# Altium schematic sheet retros.SchDoc: Retros
size A4; Organization: Badgerloop Electrical; Address1: 133 Engineering Research Building; Address2: 1500 Engineering Drive; Address3: Madison, Wi 53706; SheetNumber: 8
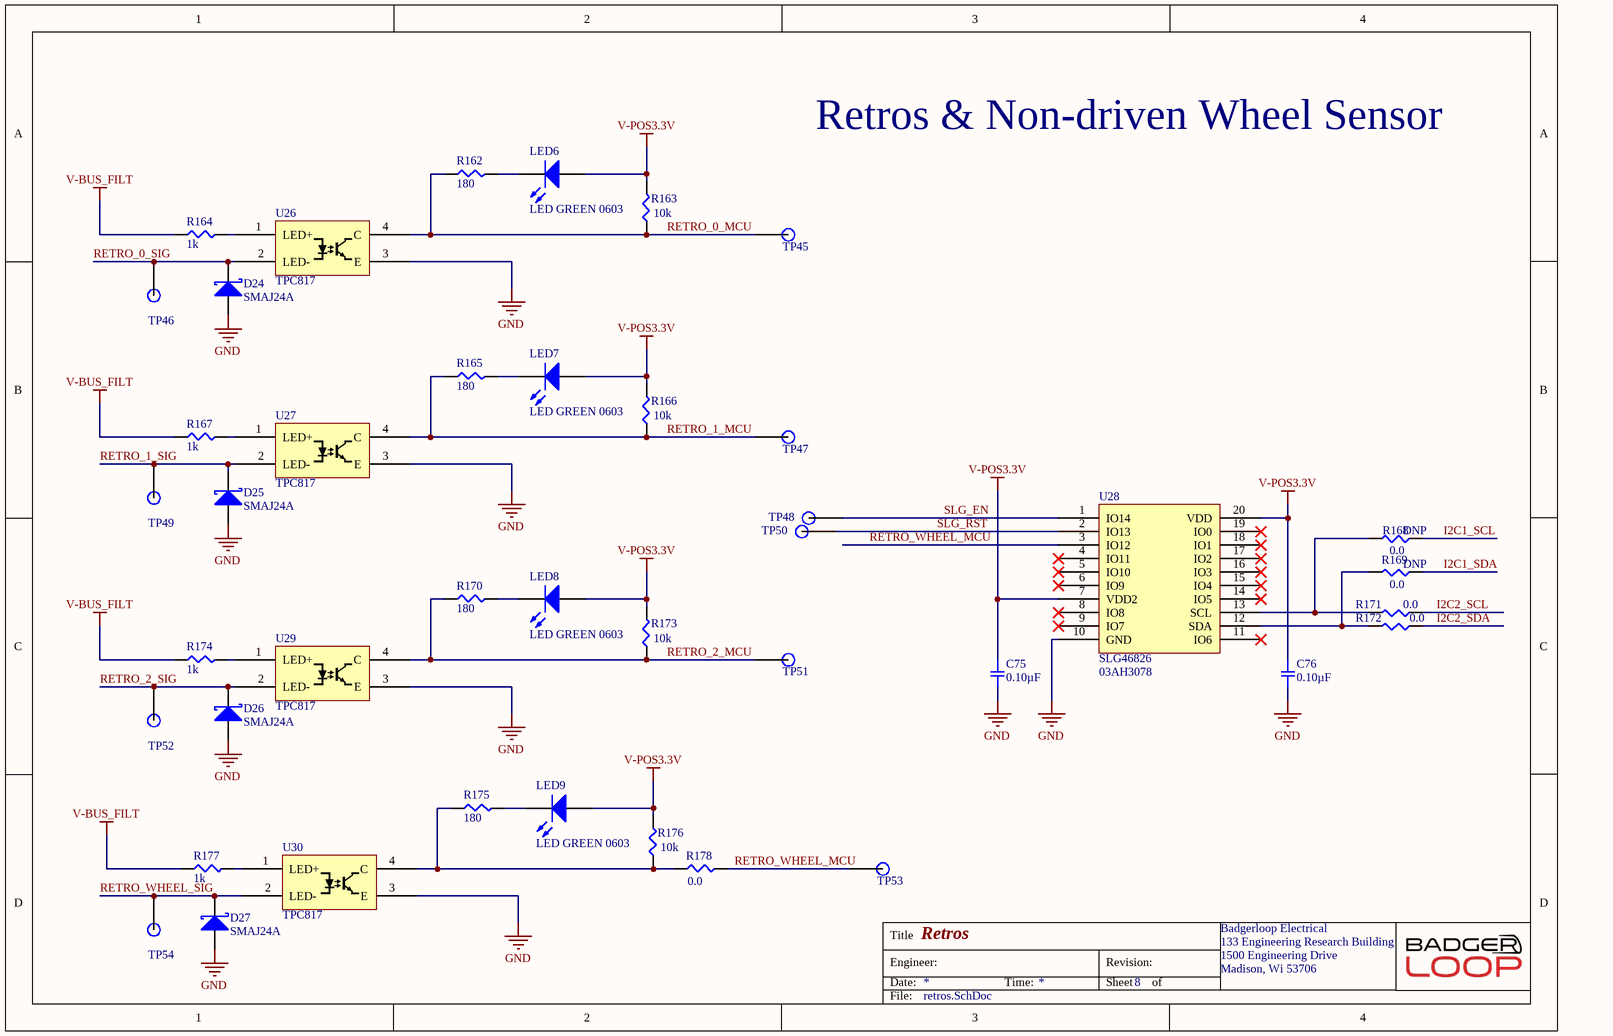
[diagram p0: retros.SchDoc]

## Parts
C75  0.10µF  [SMD-0805C]
C76  0.10µF  [SMD-0805C]
D24  SMAJ24A  [INDM5026X18N]
D25  SMAJ24A  [INDM5026X18N]
D26  SMAJ24A  [INDM5026X18N]
D27  SMAJ24A  [INDM5026X18N]
LED6  LED GREEN 0603  [LED 0603 GREEN]
LED7  LED GREEN 0603  [LED 0603 GREEN]
LED8  LED GREEN 0603  [LED 0603 GREEN]
LED9  LED GREEN 0603  [LED 0603 GREEN]
R162  180  [SMD-0805-RES]
R163  10k  [SMD-0805-RES]
R164  1k  [SMD-0805-RES]
R165  180  [SMD-0805-RES]
R166  10k  [SMD-0805-RES]
R167  1k  [SMD-0805-RES]
R168  0.0  [SMD-0805-RES]
R169  0.0  [SMD-0805-RES]
R170  180  [SMD-0805-RES]
R171  0.0  [SMD-0805-RES]
R172  0.0  [SMD-0805-RES]
R173  10k  [SMD-0805-RES]
R174  1k  [SMD-0805-RES]
R175  180  [SMD-0805-RES]
R176  10k  [SMD-0805-RES]
R177  1k  [SMD-0805-RES]
R178  0.0  [SMD-0805-RES]
TP45  TP  [Test Point]  (value not drawn)
TP46  TP  [Test Point]  (value not drawn)
TP47  TP  [Test Point]  (value not drawn)
TP48  TP  [Test Point]  (value not drawn)
TP49  TP  [Test Point]  (value not drawn)
TP50  TP  [Test Point]  (value not drawn)
TP51  TP  [Test Point]  (value not drawn)
TP52  TP  [Test Point]  (value not drawn)
TP53  TP  [Test Point]  (value not drawn)
TP54  TP  [Test Point]  (value not drawn)
U26  TPC817  [SOT200P1005X328-5N]
U27  TPC817  [SOT200P1005X328-5N]
U28  SLG46826  Supplier Part Number 1: 03AH3078  [SOP65P640X175-20N]
U29  TPC817  [SOT200P1005X328-5N]
U30  TPC817  [SOT200P1005X328-5N]

## Nets
GND: C75.2 C76.2 D24.2(K) D25.2(K) D26.2(K) D27.2(K) U26.3(E) U27.3(E) U28.10(GND) U29.3(E) U30.3(E)
V-BUS_FILT: R164.1 R167.1 R174.1 R177.1
V-POS3.3V: C75.1 C76.1 LED6.1(A) LED7.1(A) LED8.1(A) LED9.1(A) R163.2 R166.2 R173.2 R176.2 U28.7(VDD2) U28.20(VDD)
I2C1_SCL: R168.1
I2C1_SDA: R169.1
I2C2_SCL: R171.1
I2C2_SDA: R172.1
RETRO_0_MCU: R162.1 R163.1 TP45.1 U26.4(C)
RETRO_0_SIG: D24.1(A) TP46.1 U26.2(LED-)
RETRO_1_MCU: R165.1 R166.1 TP47.1 U27.4(C)
RETRO_1_SIG: D25.1(A) TP49.1 U27.2(LED-)
RETRO_2_MCU: R170.1 R173.1 TP51.1 U29.4(C)
RETRO_2_SIG: D26.1(A) TP52.1 U29.2(LED-)
RETRO_WHEEL_MCU: R178.2 TP53.1 U28.3(IO12)
RETRO_WHEEL_SIG: D27.1(A) TP54.1 U30.2(LED-)
SLG_EN: TP48.1 U28.1(IO14)
SLG_RST: TP50.1 U28.2(IO13)
NetLED6_2: LED6.2(K) R162.2
NetLED7_2: LED7.2(K) R165.2
NetLED8_2: LED8.2(K) R170.2
NetLED9_2: LED9.2(K) R175.2
NetR164_2: R164.2 U26.1(LED+)
NetR167_2: R167.2 U27.1(LED+)
NetR168_2: R168.2 R171.2 U28.13(SCL)
NetR169_2: R169.2 R172.2 U28.12(SDA)
NetR174_2: R174.2 U29.1(LED+)
NetR175_1: R175.1 R176.1 R178.1 U30.4(C)
NetR177_2: R177.2 U30.1(LED+)

Not connected (* = marked no-connect by the designer): U28 4(IO11)* 5(IO10)* 6(IO9)* 8(IO8)* 9(IO7)* 11(IO6)* 14(IO5)* 15(IO4)* 16(IO3)* 17(IO2)* 18(IO1)* 19(IO0)*

## Notes on the sheet
- Retros & Non-driven Wheel Sensor
- Title
- Engineer:
- Date:
- Time:
- Revision:
- Sheet
- of
- File:

## Library data of the parts
C75 C76 = GRM219R71E104KA01D: CAP CER 0.1UF 25V X7R 0805; Manufacturer: Murata Electronics North America; Factory Stock: 0; Unit Price (USD): 0.12; Minimum Quantity: 1; Tolerance: ±10%; Datasheets: http://www.murata.com/~/media/webrenewal/support/library/catalog/products/capacitor/mlcc/c02e.pdf; Image: //media.digikey.com/Renders/Murata%20Renders/0805%20(2012%20Metric)%20.85mm.jpg; Digi-Key Part Number: 490-12754-1-ND; Part Number: GRM219R71E104KA01D; Quantity Available: 8594; @ qty: 0; Packaging: Cut Tape (CT); Series: GRM; Part Status: Active; Value: 0.10µF; Voltage: 25V; Temperature Coefficient: X7R; Operating Temperature: -55°C ~ 125°C; Features: -; Ratings: -; Applications: General Purpose; Mounting Type: Surface Mount, MLCC; Package / Case: 0805 (2012 Metric); Size / Dimension: 0.079" L x 0.049" W (2.00mm x 1.25mm); Height - Seated (Max): -; Thickness (Max): 0.037" (0.95mm); Lead Spacing: -; Lead Style: -
D24-D27 = SMAJ24A: TVS DIODE 24V 38.9V DO214AC; Manufacturer: LittelFuse Inc; Digikey P/N: SMAJ24ALFCT-ND; Digikey Link: https://www.digikey.com/product-detail/en/littelfuse-inc/SMAJ24A/SMAJ24ALFCT-ND/762500; Manufacturer P/N: SMAJ24A
LED6-LED9 = LED GREEN 0603: Manufacturer: Lite-On Inc.; Manufacturer P/N: LTST-C190KGKT; Digikey P/N: 160-1435-1-ND; Package / Case: 0603; Color: GREEN
R162 R165 R170 R175 = ERJ-6ENF1800V: RES SMD 180 OHM 1% 1/8W 0805; Manufacturer: Panasonic Electronic Components; Factory Stock: 0; Unit Price (USD): 0.00729; @ qty: 1500; Minimum Quantity: 1; Power (Watts): 0.125W, 1/8W; Temperature Coefficient: ±100ppm/°C; Part Number: ERJ-6ENF1800V; Datasheets: http://industrial.panasonic.com/www-cgi/jvcr13pz.cgi?E+PZ+3+AOA0002+ERJ6ENF1800V+7+WW; Image: //media.digikey.com/Renders/Panasonic%20Renders/ERJ-0805%20Pkg.jpg; Digi-Key Part Number: P180CCT-ND; Quantity Available: 33231; Packaging: Cut Tape (CT); Series: ERJ; Part Status: Active; Value: 180; Tolerance: ±1%; Composition: Thick Film; Features: Automotive AEC-Q200; Operating Temperature: -55°C ~ 155°C; Package / Case: 0805 (2012 Metric); Supplier Device Package: 0805; Size / Dimension: 0.079" L x 0.049" W (2.00mm x 1.25mm); Height - Seated (Max): 0.028" (0.70mm); Number of Terminations: 2; Failure Rate: -
R163 R166 R173 R176 = ERJ-6GEYJ103V: RES SMD 10K OHM 5% 1/8W 0805; Manufacturer: Panasonic Electronic Components; Factory Stock: 0; Unit Price (USD): 0.00496; @ qty: 1500; Minimum Quantity: 1; Power (Watts): 0.125W, 1/8W; Temperature Coefficient: ±200ppm/°C; Part Number: ERJ-6GEYJ103V; Datasheets: http://industrial.panasonic.com/www-cgi/jvcr13pz.cgi?E+PZ+3+AOA0001+ERJ6GEYJ103V+7+WW; Image: //media.digikey.com/Renders/Panasonic%20Renders/ERJ-0805%20Pkg.jpg; Digi-Key Part Number: P10KACT-ND; Quantity Available: 2328224; Packaging: Cut Tape (CT); Series: ERJ; Part Status: Active; Value: 10k; Tolerance: ±5%; Composition: Thick Film; Features: Automotive AEC-Q200; Operating Temperature: -55°C ~ 155°C; Package / Case: 0805 (2012 Metric); Supplier Device Package: 0805; Size / Dimension: 0.079" L x 0.049" W (2.00mm x 1.25mm); Height - Seated (Max): 0.028" (0.70mm); Number of Terminations: 2; Failure Rate: -
R164 R167 R174 R177 = ERJ-6ENF1001V: RES SMD 1K OHM 1% 1/8W 0805; Manufacturer: Panasonic Electronic Components; Factory Stock: 0; Unit Price (USD): 0.00729; @ qty: 1500; Minimum Quantity: 1; Power (Watts): 0.125W, 1/8W; Temperature Coefficient: ±100ppm/°C; Part Number: ERJ-6ENF1001V; Datasheets: http://industrial.panasonic.com/www-cgi/jvcr13pz.cgi?E+PZ+3+AOA0002+ERJ6ENF1001V+7+WW; Image: //media.digikey.com/Renders/Panasonic%20Renders/ERJ-0805%20Pkg.jpg; Digi-Key Part Number: P1.00KCCT-ND; Quantity Available: 12895103; Packaging: Cut Tape (CT); Series: ERJ; Part Status: Active; Value: 1k; Tolerance: ±1%; Composition: Thick Film; Features: Automotive AEC-Q200; Operating Temperature: -55°C ~ 155°C; Package / Case: 0805 (2012 Metric); Supplier Device Package: 0805; Size / Dimension: 0.079" L x 0.049" W (2.00mm x 1.25mm); Height - Seated (Max): 0.028" (0.70mm); Number of Terminations: 2; Failure Rate: -
R168 R169 R171 R172 R178 = ERJ-6GEY0R00V: RES SMD 0.0 OHM JUMPER 1/8W 0805; Manufacturer: Panasonic Electronic Components; Factory Stock: 0; Unit Price (USD): 0.00544; @ qty: 1500; Minimum Quantity: 1; Power (Watts): 0.125W, 1/8W; Part Number: ERJ-6GEY0R00V; Datasheets: http://industrial.panasonic.com/www-cgi/jvcr13pz.cgi?E+PZ+3+AOA0001+ERJ6GEY0R00V+7+WW; Image: //media.digikey.com/Renders/Panasonic%20Renders/ERJ-0805%20Pkg.jpg; Digi-Key Part Number: P0.0ACT-ND; Quantity Available: 1597627; Packaging: Cut Tape (CT); Series: ERJ; Part Status: Active; Value: 0.0; Tolerance: Jumper; Composition: Thick Film; Features: Automotive AEC-Q200; Temperature Coefficient: -; Operating Temperature: -55°C ~ 155°C; Package / Case: 0805 (2012 Metric); Supplier Device Package: 0805; Size / Dimension: 0.079" L x 0.049" W (2.00mm x 1.25mm); Height - Seated (Max): 0.028" (0.70mm); Number of Terminations: 2; Failure Rate: -
  R168 R169: DNP: DNP
TP45-TP54 = TP: SMD TEST POINT
U26 U27 U29 U30 = TPC817: OPTOISO 5KV TRANS 4SOP; Manufacturer: Taiwan Semi; Manufacturer P/N: TPC817S1B RAG; Digikey Link: https://www.digikey.com/product-detail/en/taiwan-semiconductor-corporation/TPC817S1B-RAG/TPC817S1BRAGCT-ND/7359679; Digikey P/N: TPC817S1BRAGCT-ND
U28 = SLG46826: GreenPAK Programmable Mixed Signal Matrix with In-System Programmability; Manufacturer: Dialog Semiconductor; Manufacturer Part Number: SLG46826V-SKT; Supplier 1: Newark; Stock 1: 4; Pricing 1: 1=45.65000, 5=44.43000, 10=43.15000, 25=42.51000, 50=41.89000, 100=39.38000 (USD); RoHS: No